# Altium schematic sheet top level.SchDoc
size A4
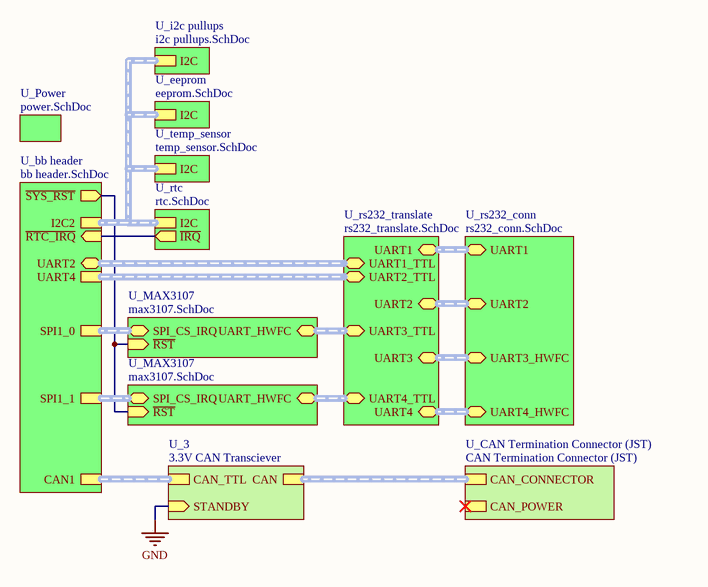
[diagram p0: top level.SchDoc]

## Sub-sheets
U_3 = 3.3V CAN Transciever: CAN_TTL (harness CAN_TTL), CAN (harness CAN), STANDBY (in)
U_bb header = bb header.SchDoc: ~{SYS_RST} (out), I2C2 (harness I2C), UART4 (harness RS232_TTL), CAN1 (harness CAN_TTL), SPI1_0 (harness SPI_CS_IRQ), SPI1_1 (harness SPI_CS_IRQ), UART2 (harness RS232_TTL), ~{RTC_IRQ} (in)
U_CAN Termination Connector (JST) = CAN Termination Connector (JST): CAN_CONNECTOR (harness CAN), CAN_POWER
U_eeprom = eeprom.SchDoc: I2C (harness I2C)
U_i2c pullups = i2c pullups.SchDoc: I2C (harness I2C)
U_MAX3107 = max3107.SchDoc: UART_HWFC (harness RS232_HWFC_TTL), SPI_CS_IRQ (harness SPI_CS_IRQ), ~{RST} (in)
U_MAX3107 = max3107.SchDoc: UART_HWFC (harness RS232_HWFC_TTL), SPI_CS_IRQ (harness SPI_CS_IRQ), ~{RST} (in)
U_Power = power.SchDoc: no entries
U_rs232_conn = rs232_conn.SchDoc: UART3_HWFC (harness RS232_HWFC), UART4_HWFC (harness RS232_HWFC), UART1 (harness RS232), UART2 (harness RS232)
U_rs232_translate = rs232_translate.SchDoc: UART1_TTL (harness RS232_TTL), UART2_TTL (harness RS232_TTL), UART1 (harness RS232), UART2 (harness RS232), UART3 (harness RS232_HWFC), UART4 (harness RS232_HWFC), UART3_TTL (harness RS232_HWFC_TTL), UART4_TTL (harness RS232_HWFC_TTL)
U_rtc = rtc.SchDoc: I2C (harness I2C), ~{IRQ} (out)
U_temp_sensor = temp_sensor.SchDoc: I2C (harness I2C)

## Nets
GND: sheet U_3/STANDBY
(unnamed): sheet U_bb header/~{SYS_RST}, sheet U_MAX3107/~{RST}, sheet U_MAX3107/~{RST}
(unnamed): sheet U_bb header/~{RTC_IRQ}, sheet U_rtc/~{IRQ}

## Buses and harness runs
harness sheet U_3/CAN = sheet U_CAN Termination Connector (JST)/CAN_CONNECTOR
harness sheet U_3/CAN_TTL = sheet U_bb header/CAN1
harness sheet U_bb header/I2C2 = sheet U_eeprom/I2C = sheet U_i2c pullups/I2C = sheet U_rtc/I2C = sheet U_temp_sensor/I2C
harness sheet U_bb header/SPI1_0 = sheet U_MAX3107/SPI_CS_IRQ
harness sheet U_bb header/SPI1_1 = sheet U_MAX3107/SPI_CS_IRQ
harness sheet U_bb header/UART2 = sheet U_rs232_translate/UART1_TTL
harness sheet U_bb header/UART4 = sheet U_rs232_translate/UART2_TTL
harness sheet U_MAX3107/UART_HWFC = sheet U_rs232_translate/UART3_TTL
harness sheet U_MAX3107/UART_HWFC = sheet U_rs232_translate/UART4_TTL
harness sheet U_rs232_conn/UART1 = sheet U_rs232_translate/UART1
harness sheet U_rs232_conn/UART2 = sheet U_rs232_translate/UART2
harness sheet U_rs232_conn/UART3_HWFC = sheet U_rs232_translate/UART3
harness sheet U_rs232_conn/UART4_HWFC = sheet U_rs232_translate/UART4